# Altium schematic sheet HONG NGOAI.SchDoc
size A
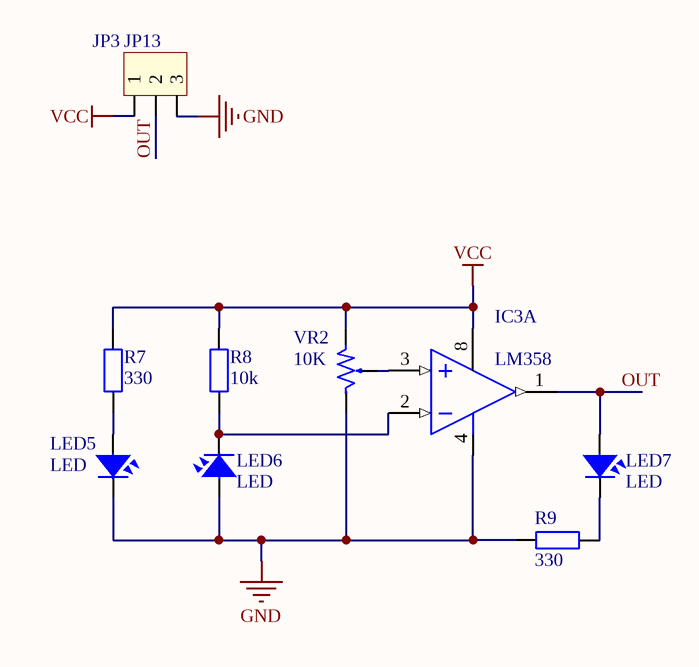
[diagram p0: HONG NGOAI.SchDoc]

## Parts
IC3  LM358  [DIP8/W0.3]  (part A of 2)
JP13  JP3  [CON3]
LED5  LED  [LED-3]
LED6  LED  [LED-3]
LED7  LED  [LED-3]
R7  330  [R1/4W]
R8  10k  [R1/4W]
R9  330  [R1/4W]
VR2  10K  [VR1]

## Nets
GND: IC3.4(-V) JP13.3 LED5.2 LED6.1 R9.2 VR2.3
VCC: IC3.8(+V) JP13.1 R7.2 R8.2 VR2.1
OUT: IC3.1(OUT) JP13.2 LED7.1
NetIC3_2: IC3.2(IN-) LED6.2 R8.1
NetIC3_3: IC3.3(IN+) VR2.2
NetLED5_1: LED5.1 R7.1
NetLED7_2: LED7.2 R9.1

## Library data of the parts
IC3 = LM358: Low-Power Dual Operational Amplifier; Value: LM358
JP13 = Con3: Connector 3; Value: Connector 3
LED5-LED7 = LED: LED Single colour Green and Red; Value: LED 3 ly Single Colour; Description: LED 5 ly Single Colour; Description: Led  Vuong
R7-R9 = R1/4W: Resistor 1/4W; Value: R1/4W - 1K
VR2 = VR1: Var Resistor; Value: VR 10K